# Altium project Nano-Arduino-LoRa.PrjPcb
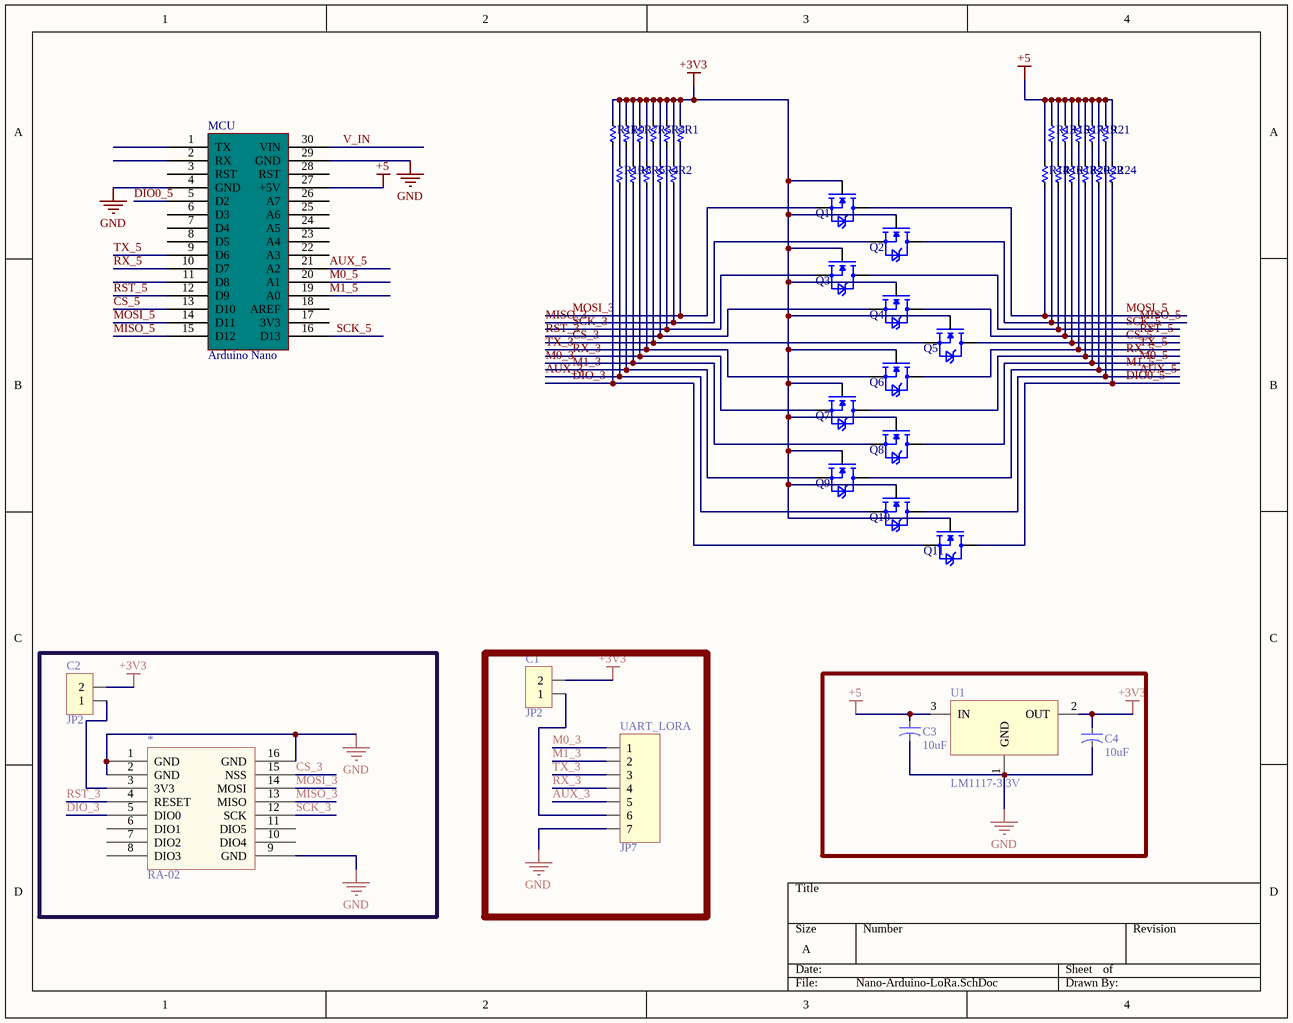
[diagram p0: Nano-Arduino-LoRa.SchDoc]
1 sheet, 41 parts. Net scope: global (net labels, ports and power ports of the same name join across sheets).
Board file: Nano-Arduino-LoRa.PcbDoc

## Sheet Nano-Arduino-LoRa.SchDoc
size A

### Parts
*  RA-02  [RA-02]
C1  JP2  [JP2-C1T]
C2  JP2  [JP2-C1T]
C3  10uF  [CAP-ALU-SMD-4.5x5x1.4]
C4  10uF  [CAP-ALU-SMD-4.5x5x1.4]
MCU  Arduino Nano  [PCBComponent_1]
Q1  BSS138  [SOT-23-3L]  (value not drawn)
Q2  BSS138  [SOT-23-3L]  (value not drawn)
Q3  BSS138  [SOT-23-3L]  (value not drawn)
Q4  BSS138  [SOT-23-3L]  (value not drawn)
Q5  BSS138  [SOT-23-3L]  (value not drawn)
Q6  BSS138  [SOT-23-3L]  (value not drawn)
Q7  BSS138  [SOT-23-3L]  (value not drawn)
Q8  BSS138  [SOT-23-3L]  (value not drawn)
Q9  BSS138  [SOT-23-3L]  (value not drawn)
Q10  BSS138  [SOT-23-3L]  (value not drawn)
Q11  BSS138  [SOT-23-3L]  (value not drawn)
R1  Res  [RES-SMD-0805]  (value not drawn)
R2  Res  [RES-SMD-0805]  (value not drawn)
R3  Res  [RES-SMD-0805]  (value not drawn)
R4  Res  [RES-SMD-0805]  (value not drawn)
R5  Res  [RES-SMD-0805]  (value not drawn)
R6  Res  [RES-SMD-0805]  (value not drawn)
R7  Res  [RES-SMD-0805]  (value not drawn)
R8  Res  [RES-SMD-0805]  (value not drawn)
R9  Res  [RES-SMD-0805]  (value not drawn)
R10  Res  [RES-SMD-0805]  (value not drawn)
R11  Res  [RES-SMD-0805]  (value not drawn)
R13  Res  [RES-SMD-0805]  (value not drawn)
R14  Res  [RES-SMD-0805]  (value not drawn)
R15  Res  [RES-SMD-0805]  (value not drawn)
R16  Res  [RES-SMD-0805]  (value not drawn)
R17  Res  [RES-SMD-0805]  (value not drawn)
R18  Res  [RES-SMD-0805]  (value not drawn)
R19  Res  [RES-SMD-0805]  (value not drawn)
R20  Res  [RES-SMD-0805]  (value not drawn)
R21  Res  [RES-SMD-0805]  (value not drawn)
R22  Res  [RES-SMD-0805]  (value not drawn)
R24  Res  [RES-SMD-0805]  (value not drawn)
U1  LM1117-3.3V  [SOT223]
UART_LORA  JP7  [JP7-C1T]

### Nets
+3V3: C1.2 C2.2 C4.1 Q1.1 Q2.1 Q3.1 Q4.1 Q5.1 Q6.1 Q7.1 Q8.1 Q9.1 Q10.1 Q11.1 R1.1 R2.1 R3.1 R4.1 R5.1 R6.1 R7.1 R8.1 R9.1 R10.1 R11.1 U1.2(OUT)
+5: C3.1 MCU.27(+5V) R13.1 R14.1 R15.1 R16.1 R17.1 R18.1 R19.1 R20.1 R21.1 R22.1 R24.1 U1.3(IN)
GND: *.1(GND) *.2(GND) *.9(GND) *.16(GND) C3.2 C4.2 MCU.4(GND) MCU.29(GND) U1.1(GND) UART_LORA.7
AUX_3: Q10.2 R10.2 UART_LORA.5
AUX_5: MCU.21(A2) Q10.3 R21.2
CS_3: *.15(NSS) Q5.2 R5.2
CS_5: MCU.13(D10) Q5.3 R18.2
DIO0_5: MCU.5(D2) Q11.3 R24.2
DIO_3: *.5(DIO0) Q11.2 R11.2
M0_3: Q8.2 R8.2 UART_LORA.1
M0_5: MCU.20(A1) Q8.3 R19.2
M1_3: Q9.2 R9.2 UART_LORA.2
M1_5: MCU.19(A0) Q9.3 R22.2
MISO_3: *.13(MISO) Q2.2 R2.2
MISO_5: MCU.15(D12) Q2.3 R13.2
MOSI_3: *.14(MOSI) Q1.2 R1.2
MOSI_5: MCU.14(D11) Q1.3 R14.2
RST_3: *.4(RESET) Q4.2 R4.2
RST_5: MCU.12(D9) Q4.3 R15.2
RX_3: Q7.2 R7.2 UART_LORA.4
RX_5: MCU.10(D7) Q7.3 R20.2
SCK_3: *.12(SCK) Q3.2 R3.2
SCK_5: MCU.16(D13) Q3.3 R16.2
TX_3: Q6.2 R6.2 UART_LORA.3
TX_5: MCU.9(D6) Q6.3 R17.2
V_IN: MCU.30(VIN)
Net*_3: *.3(3V3) C2.1
NetC1_1: C1.1 UART_LORA.6

Not connected (* = marked no-connect by the designer): * 6(DIO1) 7(DIO2) 8(DIO3) 10(DIO4) 11(DIO5); MCU 1(TX) 2(RX) 3(RST) 6(D3) 7(D4) 8(D5) 11(D8) 17(3V3) 18(AREF) 22(A3) 23(A4) 24(A5) 25(A6) 26(A7) 28(RST)

### Library data of the parts
C1 C2 = JP2: WR-PHD 2.54 mm Angled Socket Header; Manufacturer: W¨¹rth Elektronik eiSos GmbH; partNo: 613002143121; ComponentLink1 Description: Manufacturer; ComponentLink2 Description: Datasheet; NoPins: 02; Created Date: 29 March 2013; ComponentLink1URL: http://www.we-online.com; ComponentLink2URL: http://katalog.we-online.de/em/datasheet/6130xx143121.pdf; Created by: Karrer Zheng
C3 C4 = CN-ALU-SMD: Polarized Capacitor (Axial); Published: 8-Jun-2000; LatestRevisionDate: 17-Jul-2002; LatestRevisionNote: Re-released for DXP Platform.; PackageReference: POLAR0.8; Publisher: Altium Limited
MCU = Component_1
Q1-Q11 = BSS138: FET SM NCH 50V 220mA SOT23-3L; Type: NMOS; Vdss: 50V; Id: 220mA
R1-R11 R13-R22 R24 = Res-SMD: Resistor; Manufacturer: Generic Components; Class: Passive; Published: 08/06/2000; Publisher: Altium Hobart Technology Centre
U1 = LM1117: 800mA Low-Dropout Linear Regulator; Creator: Nguyen Ba Bien; Website: http://group3i.net
UART_LORA = JP7: WR-PHD 2.54 mm Angled Socket Header; Manufacturer: W¨¹rth Elektronik eiSos GmbH; partNo: 613007143121; ComponentLink1 Description: Manufacturer; ComponentLink2 Description: Datasheet; NoPins: 07; Created Date: 29 March 2013; ComponentLink1URL: http://www.we-online.com; ComponentLink2URL: http://katalog.we-online.de/em/datasheet/6130xx143121.pdf; Created by: Karrer Zheng